# EAGLE board RPiOperant (EAGLE 9.1.3)
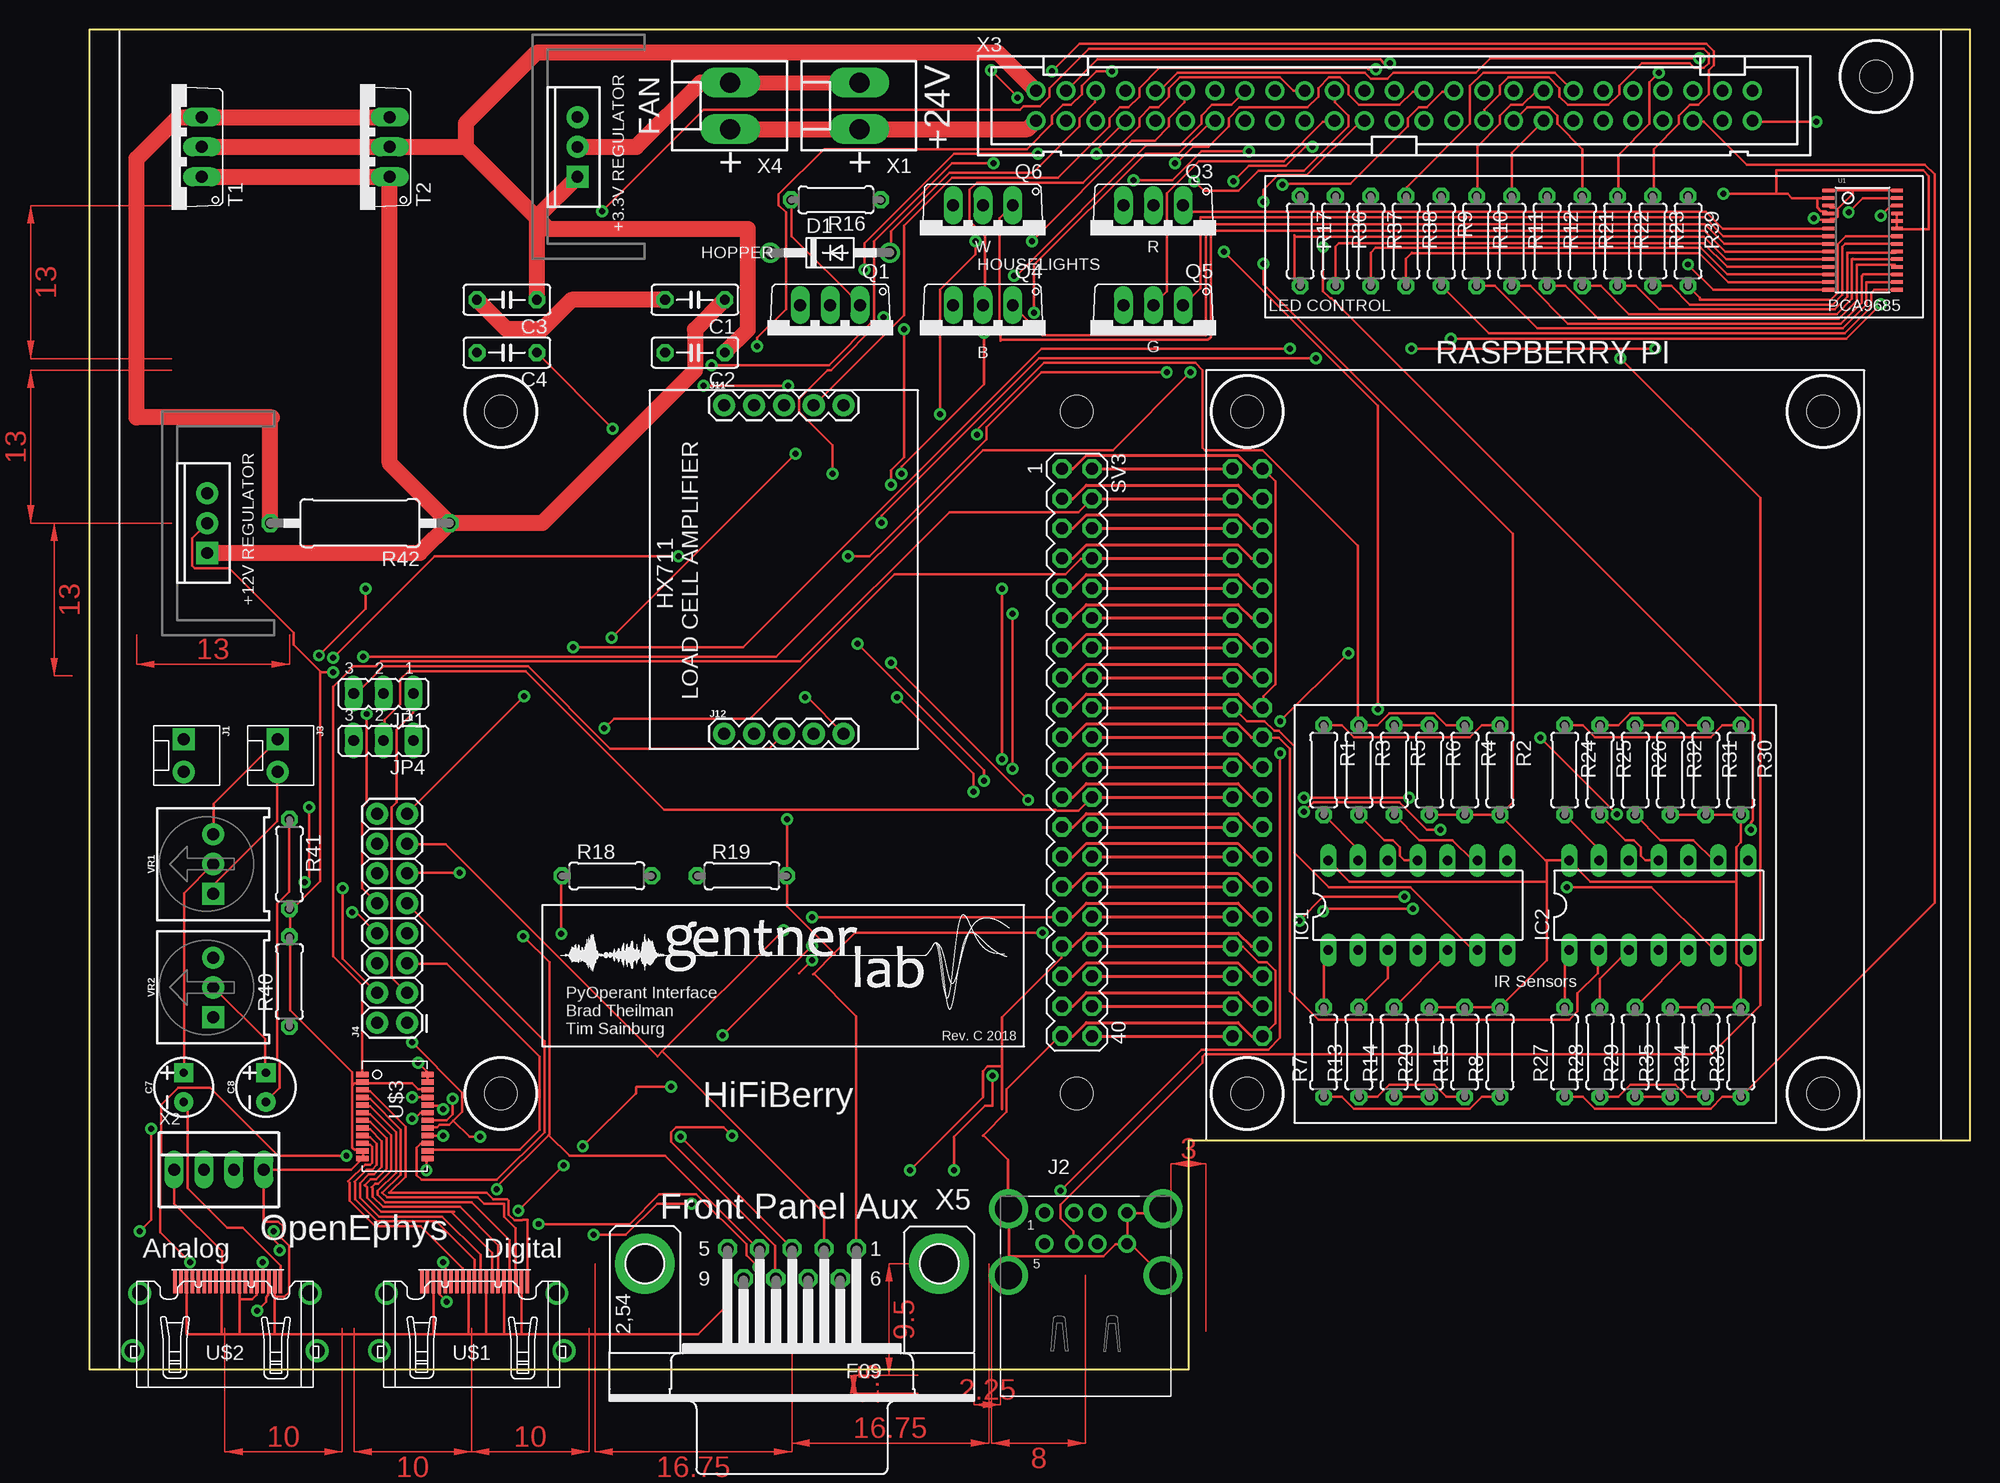
[diagram p3: board, top side]
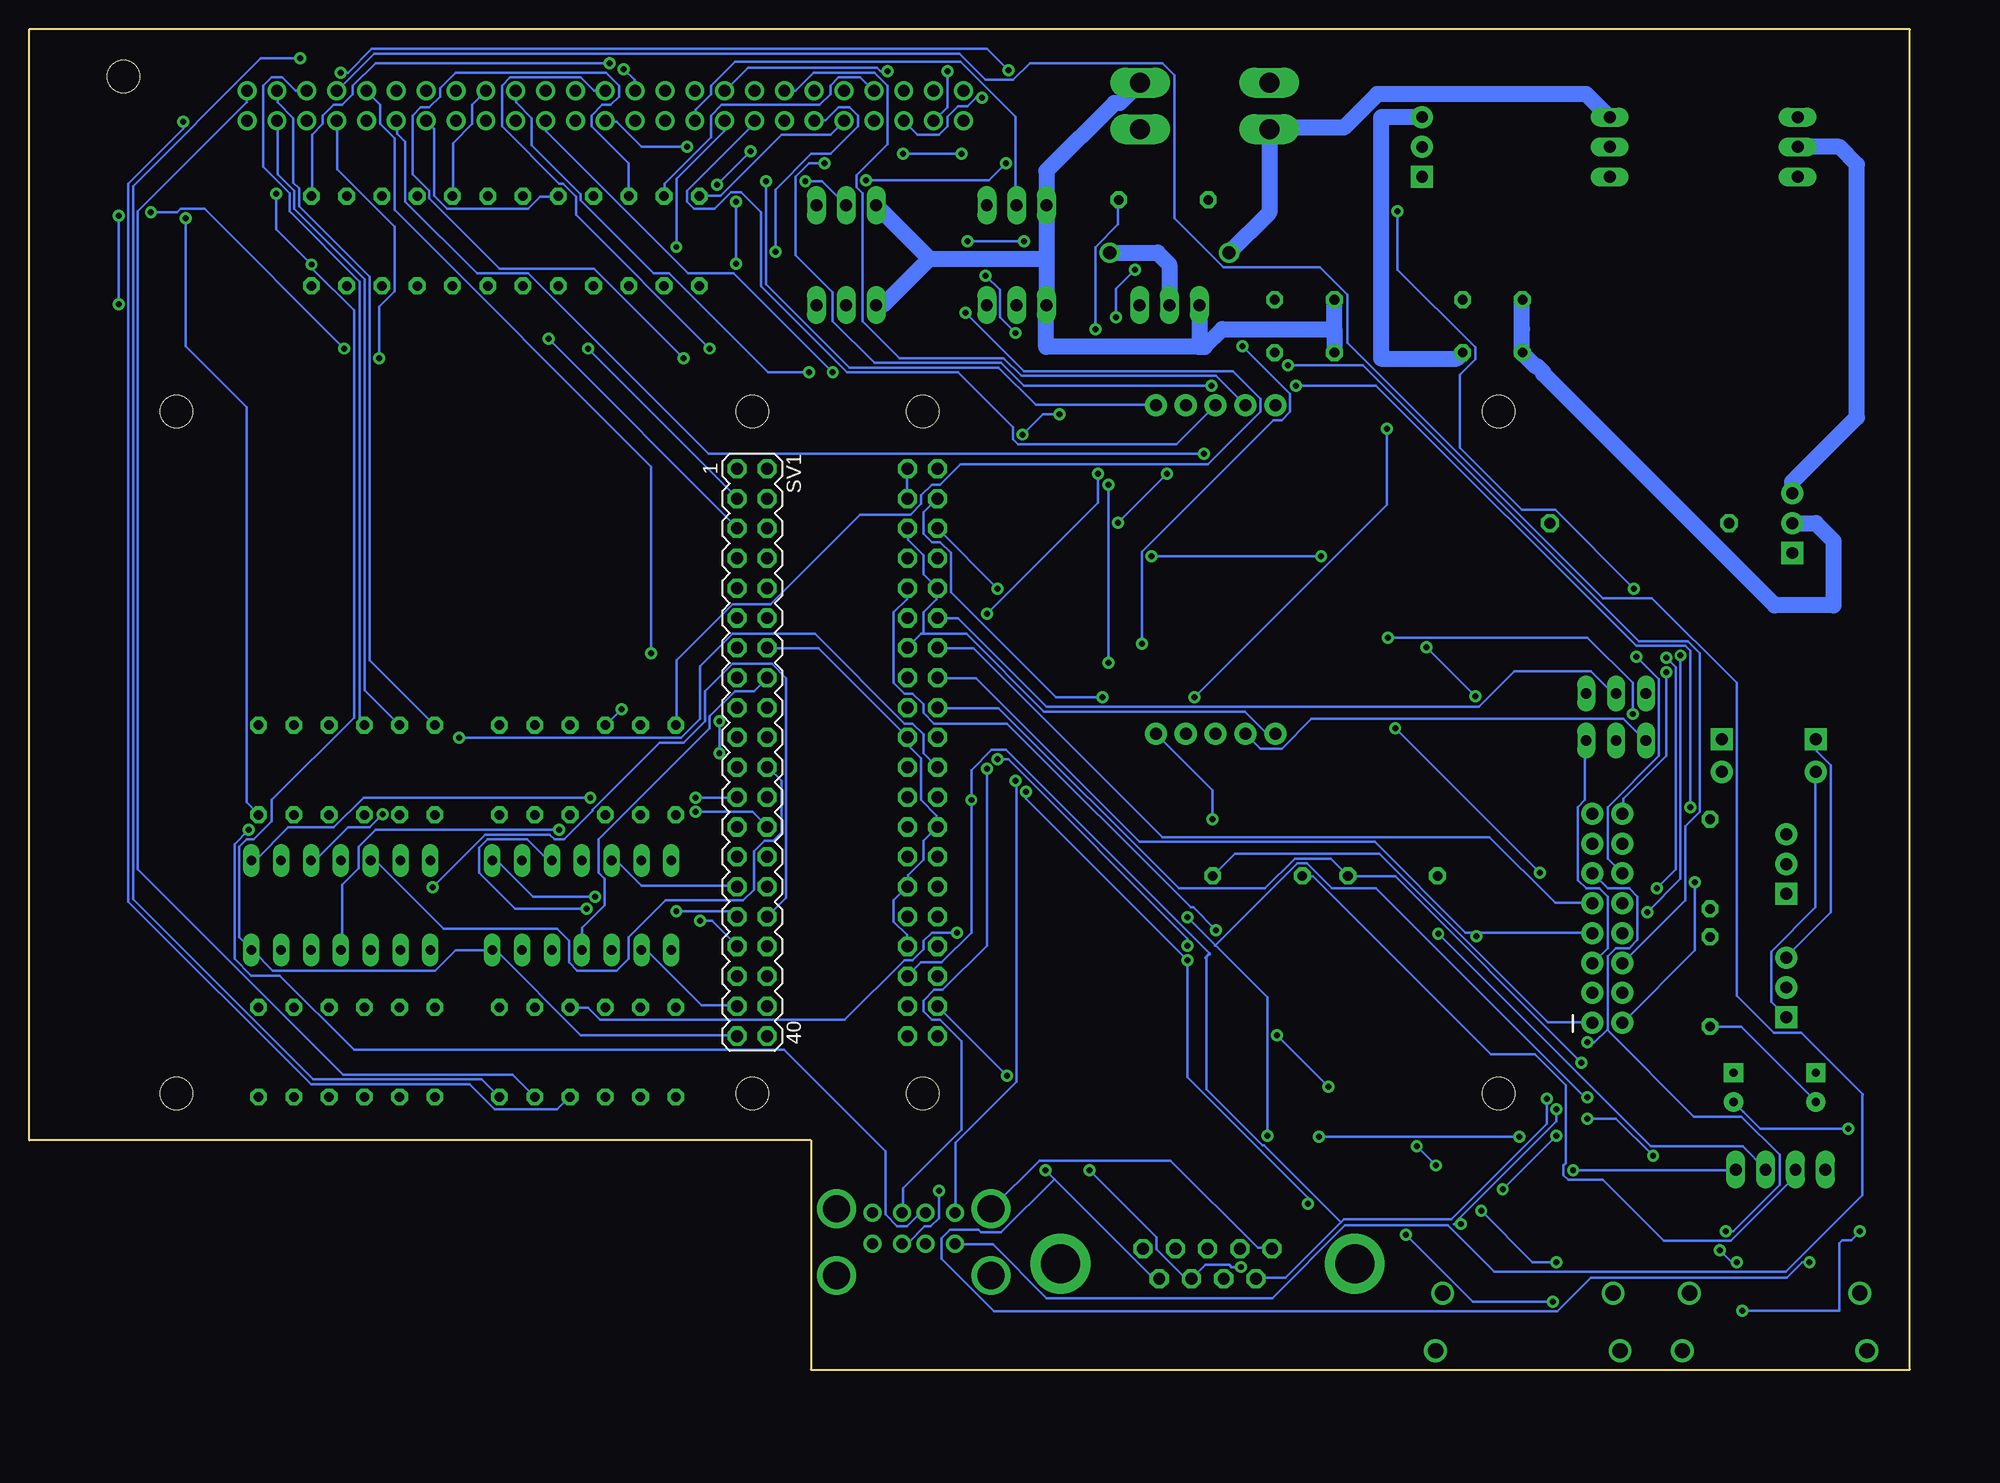
[diagram p4: board, bottom side, seen from below]

Size 160 x 114 mm. Coordinates in mm from the lower left corner, seen from the top.
Outline: 93.5,19.5 93.5,0 0,0 0,114 160,114 160,19.5 93.5,19.5
Copper layers (1*16): Top 0.035mm / dielectric 1.5mm / Bottom 0.035mm
Design rules "SparkFun": minimum track width 8mil, minimum drill 20mil, track to track 8mil, track to pad 8mil, pad to pad 8mil, via to via 8mil, smd to smd 8mil, copper to edge 8mil, drill to drill 8mil, minimum pad ring 12mil, minimum via ring 10mil, stop-mask expansion 4mil, vias tented up to drill 20mil, thermal gap 10mil
Net classes: 0 default: width 0.152 mm; 1 12V: width 1.372 mm, clearance 0.254 mm; 2 5V: width 0.508 mm; 3 GND: width 0.203 mm; 4 24V: width 1.372 mm
Holes 2.75 mm at 35,23.5 35,81.5 147.5,23.5 147.5,81.5 98.5,81.5 98.5,23.5 152,110 84,81.5 84,23.5
tKeepout: area 0,0 to 2,114; area 2,113 to 159,114
bKeepout: area 0,0 to 2,114; area 2,113 to 159,114
tRestrict: area 32,20.5 to 38,26.5; area 95,20.5 to 101.5,26.5; area 144.5,20.5 to 150.5,26.5; area 148.5,107 to 155,113; area 32,78.5 to 38,84.5; area 95,78.5 to 101.5,85; area 144.5,78.5 to 150.5,84.5; area 0,0 to 2,114; area 2,113 to 159,114; area 81,20.5 to 87,26.5; area 81,78.5 to 87,84.5; area 0,0 to 93.5,2; 3 more areas
bRestrict: area 32,78.5 to 38,84.5; area 32,20.5 to 38,26.5; area 95.5,78.5 to 101.5,84.5; area 32,78.5 to 38,84.5; area 95.5,20.5 to 101.5,26.5; area 144.5,20.5 to 150.5,26.5; area 144.5,78.5 to 150.5,84.5; area 149,107 to 155,113; area 0,0 to 2,114; area 2,113 to 159,114; area 81,20.5 to 87,26.5; area 81,78.5 to 87,84.5; 3 more areas
vRestrict: area 32,20.5 to 38,26.5; area 95.5,20.5 to 101.5,26.5; area 144.5,20.5 to 150.5,26.5; area 144.5,78.5 to 150.5,84.5; area 95.5,78.5 to 101.5,84.5; area 149,107 to 155,113; area 32,78.5 to 38,84.5; area 0,0 to 2,114; area 2,113 to 159,114; area 81,20.5 to 87,26.5; area 81,78.5 to 87,84.5; area 0,0 to 93.5,2; 3 more areas

## Footprints (pad centres in the part's own frame; a part is rotated, then mirrored left to right if it is on the bottom)
C050-025X075 = drill 0.813 octagon: 1 -2.54,0; 2 2.54,0
CPOL-RADIAL-2.5MM-5MM = drill 0.7 pad 1.651 square: 1 1.25,0 | drill 0.7 pad 1.651: 2 -1.25,0
DO41-10 = drill 1.118: A 5.08,0; C -5.08,0
DIL14 = drill 0.813 long: 1 -7.62,-3.81; 2 -5.08,-3.81; 3 -2.54,-3.81; 4 0,-3.81; 5 2.54,-3.81; 6 5.08,-3.81; 7 7.62,-3.81; 8 7.62,3.81; 9 5.08,3.81; 10 2.54,3.81; 11 0,3.81; 12 -2.54,3.81; 13 -5.08,3.81; 14 -7.62,3.81
MOLEX-1X2_LOCK = drill 1.016 pad 1.88 square: 1 -0.127,0 | drill 1.016 pad 1.88: 2 2.667,0
61400826021 = drill 0.92: 1 -3.5,5.33; 2 -1,5.33; 3 1,5.33; 4 3.5,5.33; 5 -3.5,2.71; 6 -1,2.71; 7 1,2.71; 8 3.5,2.71 | drill 2.3: SHELL -6.57,5.68; SHELL1 6.57,5.68; SHELL2 6.57,0; SHELL3 -6.57,0
2X8 = drill 1.016 pad 1.88: 1 0,0; 2 0,2.54; 3 2.54,0; 4 2.54,2.54; 5 5.08,0; 6 5.08,2.54; 7 7.62,0; 8 7.62,2.54; 9 10.16,0; 10 10.16,2.54; 11 12.7,0; 12 12.7,2.54; 13 15.24,0; 14 15.24,2.54; 15 17.78,0; 16 17.78,2.54
1X05 = drill 1.016 pad 1.88: 1 0,0; 2 2.54,0; 3 5.08,0; 4 7.62,0; 5 10.16,0
JP2 = drill 0.914 long: 1 -2.54,0; 2 0,0; 3 2.54,0
TO220V = drill 1.016 long: 1 -2.54,-2.54; 2 0,-2.54; 3 2.54,-2.54
0207/7 = drill 0.813 octagon: 1 -3.81,0; 2 3.81,0
0411/15 = drill 0.914 octagon: 1 -7.62,0; 2 7.62,0
MA20-2 = drill 1.016 octagon: 1 -24.13,-1.27; 2 -24.13,1.27; 3 -21.59,-1.27; 4 -21.59,1.27; 5 -19.05,-1.27; 6 -19.05,1.27; 7 -16.51,-1.27; 8 -16.51,1.27; 9 -13.97,-1.27; 10 -13.97,1.27; 11 -11.43,-1.27; 12 -11.43,1.27; 13 -8.89,-1.27; 14 -8.89,1.27; 15 -6.35,-1.27; 16 -6.35,1.27; 17 -3.81,-1.27; 18 -3.81,1.27; 19 -1.27,-1.27; 20 -1.27,1.27; 21 1.27,-1.27; 22 1.27,1.27; 23 3.81,-1.27; 24 3.81,1.27; 25 6.35,-1.27; 26 6.35,1.27; 27 8.89,-1.27; 28 8.89,1.27; 29 11.43,-1.27; 30 11.43,1.27; 31 13.97,-1.27; 32 13.97,1.27; 33 16.51,-1.27; 34 16.51,1.27; 35 19.05,-1.27; 36 19.05,1.27; 37 21.59,-1.27; 38 21.59,1.27; 39 24.13,-1.27; 40 24.13,1.27
TSSOP28 = smd 0.305 x 0.991: 1 -4.225,-2.918; 2 -3.575,-2.918; 3 -2.925,-2.918; 4 -2.275,-2.918; 5 -1.625,-2.918; 6 -0.975,-2.918; 7 -0.325,-2.918; 8 0.325,-2.918; 9 0.975,-2.918; 10 1.625,-2.918; 11 2.275,-2.918; 12 2.925,-2.918; 13 3.575,-2.918; 14 4.225,-2.918; 15 4.225,2.918; 16 3.575,2.918; 17 2.925,2.918; 18 2.275,2.918; 19 1.625,2.918; 20 0.975,2.918; 21 0.325,2.918; 22 -0.325,2.918; 23 -0.975,2.918; 24 -1.625,2.918; 25 -2.275,2.918; 26 -2.925,2.918; 27 -3.575,2.918; 28 -4.225,2.918
TO220-IGO = drill 1 pad 1.88: GND 0,0; OUT 2.54,0 | drill 1 pad 1.88 square: IN -2.54,0
HDMI_A = smd 0.3 x 1.9: P$1 4.75,3.95; P$2 4.25,3.95; P$3 3.75,3.95; P$4 3.25,3.95; P$5 2.75,3.95; P$6 2.25,3.95; P$7 1.75,3.95; P$8 1.25,3.95; P$9 0.75,3.95; P$10 0.25,3.95; P$11 -0.25,3.95; P$12 -0.75,3.95; P$13 -1.25,3.95; P$14 -1.75,3.95; P$15 -2.25,3.95; P$16 -2.75,3.95; P$17 -3.25,3.95; P$18 -3.75,3.95; P$19 -4.25,3.95 | drill 1.3: P$20 -7.25,3; P$21 7.25,3; P$22 7.85,-1.9; P$23 -7.85,-1.9
TSSOP-24 = smd 1.05 x 0.45: P1 -2.8,3.6; P2 -2.8,2.95; P3 -2.8,2.3; P4 -2.8,1.65; P5 -2.8,1; P6 -2.8,0.35; P7 -2.8,-0.3; P8 -2.8,-0.95; P9 -2.8,-1.6; P10 -2.8,-2.25; P11 -2.8,-2.9; P12 -2.8,-3.55; P13 2.75,-3.55; P14 2.75,-2.9; P15 2.75,-2.25; P16 2.75,-1.6; P17 2.75,-0.95; P18 2.75,-0.3; P19 2.75,0.35; P20 2.75,1; P21 2.75,1.65; P22 2.75,2.3; P23 2.75,2.95; P24 2.75,3.6
TRIMPOT-PTH-3386U = drill 1.016 pad 1.88 square: 1 -2.54,-0.015 | drill 1.016 pad 1.88: 2 0,-0.015; 3 2.54,-0.015
KK-156-2 = drill 1.7 pad 2.184 long: 1 -1.98,0; 2 1.98,0
22-23-2041 = drill 1 long: 1 -3.81,0; 2 -1.27,0; 3 1.27,0; 4 3.81,0
PAK100/2500-50 = drill 1 pad 1.422: 1 -30.48,-1.27; 2 -30.48,1.27; 3 -27.94,-1.27; 4 -27.94,1.27; 5 -25.4,-1.27; 6 -25.4,1.27; 7 -22.86,-1.27; 8 -22.86,1.27; 9 -20.32,-1.27; 10 -20.32,1.27; 11 -17.78,-1.27; 12 -17.78,1.27; 13 -15.24,-1.27; 14 -15.24,1.27; 15 -12.7,-1.27; 16 -12.7,1.27; 17 -10.16,-1.27; 18 -10.16,1.27; 19 -7.62,-1.27; 20 -7.62,1.27; 21 -5.08,-1.27; 22 -5.08,1.27; 23 -2.54,-1.27; 24 -2.54,1.27; 25 0,-1.27; 26 0,1.27; 27 2.54,-1.27; 28 2.54,1.27; 29 5.08,-1.27; 30 5.08,1.27; 31 7.62,-1.27; 32 7.62,1.27; 33 10.16,-1.27; 34 10.16,1.27; 35 12.7,-1.27; 36 12.7,1.27; 37 15.24,-1.27; 38 15.24,1.27; 39 17.78,-1.27; 40 17.78,1.27; 41 20.32,-1.27; 42 20.32,1.27; 43 22.86,-1.27; 44 22.86,1.27; 45 25.4,-1.27; 46 25.4,1.27; 47 27.94,-1.27; 48 27.94,1.27; 49 30.48,-1.27; 50 30.48,1.27
F09HP = drill 1.016 octagon: 1 -5.486,-1.27; 2 -2.743,-1.27; 3 0,-1.27; 4 2.743,-1.27; 5 5.486,-1.27; 6 -4.115,1.27; 7 -1.372,1.27; 8 1.372,1.27; 9 4.115,1.27 | drill 3.302 pad 5.08: G1 -12.522,0; G2 12.522,0

## Placement (x,y rotation side)
C1  100nF  [C050-025X075]  51.5,91 180 top
C2  10uF  [C050-025X075]  51.5,86.5 180 top
C3  100nF  [C050-025X075]  35.5,91 180 top
C4  10uF  [C050-025X075]  35.5,86.5 180 top
C7  10uF  [CPOL-RADIAL-2.5MM-5MM]  8,24 90 top
C8  10uF  [CPOL-RADIAL-2.5MM-5MM]  15,24 90 top
D1  1N4004  [DO41-10]  63,95 0 top
IC1  74LS14N  [DIL14]  113,39.5 0 top
IC2  74LS14N  [DIL14]  133.5,39.5 0 top
J1  [MOLEX-1X2_LOCK]  8,53.5 270 top
J2  [61400826021]  84.75,8 0 top
J3  [MOLEX-1X2_LOCK]  16,53.5 270 top
J4  [2X8]  27,29.5 90 top
J11  [1X05]  53.99,82.03 0 top
J12  [1X05]  53.99,54.09 0 top
JP1  [JP2]  25,57.5 180 top
JP4  [JP2]  25,53.5 180 top
Q1  IRLB8721  [TO220V]  63,88 180 top
Q3  IRLB8721  [TO220V]  90.5,96.5 180 top
Q4  IRLB8721  [TO220V]  76,88 180 top
Q5  IRLB8721  [TO220V]  90.5,88 180 top
Q6  IRLB8721  [TO220V]  76,96.5 180 top
R1  1k  [0207/7]  105,51 270 top
R2  4.3k  [0207/7]  120,51 270 top
R3  1k  [0207/7]  108,51 270 top
R4  4.3k  [0207/7]  117,51 270 top
R5  1k  [0207/7]  111,51 270 top
R6  4.3k  [0207/7]  114,51 270 top
R7  1k  [0207/7]  105,27 90 top
R8  4.3k  [0207/7]  120,27 90 top
R9  330  [0207/7]  115,96 270 top
R10  330  [0207/7]  118,96 270 top
R11  330  [0207/7]  121,96 270 top
R12  330  [0207/7]  124,96 270 top
R13  1k  [0207/7]  108,27 90 top
R14  1k  [0207/7]  111,27 90 top
R15  4.3k  [0207/7]  117,27 90 top
R16  1k  [0207/7]  63.5,99.5 180 top
R17  330  [0207/7]  103,96 270 top
R18  330  [0207/7]  44,42 0 top
R19  330  [0207/7]  55.5,42 0 top
R20  4.3k  [0207/7]  114,27 90 top
R21  330  [0207/7]  127,96 270 top
R22  330  [0207/7]  130,96 270 top
R23  330  [0207/7]  133,96 270 top
R24  1k  [0207/7]  125.5,51 270 top
R25  1k  [0207/7]  128.5,51 270 top
R26  1k  [0207/7]  131.5,51 270 top
R27  1k  [0207/7]  125.5,27 90 top
R28  1k  [0207/7]  128.5,27 90 top
R29  1k  [0207/7]  131.5,27 90 top
R30  4.3k  [0207/7]  140.5,51 270 top
R31  4.3k  [0207/7]  137.5,51 270 top
R32  4.3k  [0207/7]  134.5,51 270 top
R33  4.3k  [0207/7]  140.5,27 90 top
R34  4.3k  [0207/7]  137.5,27 90 top
R35  4.3k  [0207/7]  134.5,27 90 top
R36  330  [0207/7]  106,96 270 top
R37  330  [0207/7]  109,96 270 top
R38  330  [0207/7]  112,96 270 top
R39  330  [0207/7]  136,96 270 top
R40  330  [0207/7]  17,33 90 top
R41  330  [0207/7]  17,43 270 top
R42  1.5  [0411/15]  23,72 180 top
SV1  [MA20-2]  98.5,52.5 270 bottom
SV3  [MA20-2]  84,52.5 270 top
T1  TIP42  [TO220V]  7,104 90 top
T2  TIP42  [TO220V]  23,104 90 top
U1  [TSSOP28]  150.85,96.08 270 top
U2  7833  [TO220-IGO]  41.5,104 90 top
U3  7812  [TO220-IGO]  10,72 90 top
U$1  HDMI  [HDMI_A]  32.5,3.5 0 top
U$2  HDMI  [HDMI_A]  11.5,3.5 0 top
U$3  OCTAL_BUS_TRANSCEIVER  [TSSOP-24]  26,21.5 0 top
VR1  10k  [TRIMPOT-PTH-3386U]  10.5,43 90 top
VR2  10k  [TRIMPOT-PTH-3386U]  10.5,32.5 90 top
X1  [KK-156-2]  65.5,107.5 90 top
X2  22-23-2041  [22-23-2041]  11,17 0 top
X3  2550-  [PAK100/2500-50]  111,107.5 0 top
X4  [KK-156-2]  54.5,107.5 90 top
X5  [F09HP]  59.75,9 180 top

## Tracks (layer width: path | path; a pad name or v marks a point on that pad's centre or on a via)
12V
  Top 1.372: U2.IN 38.04,98 | 38.04,98 C3.1 | 32,104 T2.2 T1.2 | 32,104 38,98 38.04,98 | X3.2 77.29,112 38,112 32,106 32,104 | C2.1 56,88.46 56,97 39.04,97 38.04,98
  Bottom 1.372: U3.OUT 10,75.5 4.5,81 4.5,102.5 6,104 T1.2
24V
  Top 1.372: X4.1 X1.1 79.81,105.52 X3.1 | R42.2 15.38,80.88 15.5,81 4,81 4,103 7.54,106.54 T1.3 T2.3
  Bottom 1.372: D1.C 54.5,98.42 X4.1 53.85,105.65 48.16,105.65 45.31,108.49 27.53,108.49 25.6,106.56 T2.3
+3V3  (via drill 0.51)
  Top 0.203: R6.2 R4.2 R2.2 | R32.2 R31.2 R30.2 140.5,44.84 140.1,44.44 140.1,41.5 | R35.2 R34.2 R33.2 140.5,34.16 140.1,34.56 140.1,41.5 | R20.2 R15.2 R8.2 124,34.81 124,41.5 | R2.2 123.88,43.31 124,43.31 | 124,43.31 IC2.14 127.69,41.5 140.1,41.5 | 124,41.5 124,43.31 | IC1.14 107.19,41.5 124,41.5 | U1.1 150,100.31 | 150,100.31 U1.28 | 148.68,98.68 148.55,98.81 148.12,98.81 U1.3 | 148.68,98.68 148.73,98.63 148.73,98.08 148.55,97.9 148.12,97.9 U1.5 147.93,97.83 146.81,97.83 v146.71,97.93 | 148.68,98.68 150,100 150,100.31 | v99.87,99.35 99.87,100.37 101.09,101.58 103.53,101.58 108.1,106.16 108.41,106.16 X3.23 | v99.87,94.07 99.87,92.34 121.11,71.1 121.11,48.25 120.09,47.23 R2.2 | v59.33,46.82 59.33,42.05 R19.2 59.33,41.95 59.33,39.41 63.35,35.39 | 63.35,35.39 63.4,35.34 | v44.5,80.05 38.1,86.45 C4.1 | v60.86,57.19 61.06,57.19 64.11,54.14 J12.5 | v81.08,37.17 65.13,37.17 63.35,35.39 | 63.35,35.39 61.62,33.66 | 61.62,33.66 61.57,33.61 | 61.62,33.66 65.23,30.06 65.23,10.35 X5.1
  Bottom 0.203: v99.87,94.07 v99.87,99.35 | v146.71,97.93 146.71,87.06 141.53,81.87 141.53,48.25 140.51,47.23 R30.2 | v59.33,46.82 59.33,49.26 64.11,54.04 J12.5 | J4.1 27.03,29.55 30.79,29.55 45.11,43.88 57.4,43.88 59.23,42.05 R19.2 | v44.5,80.05 44.5,73.54 v60.86,57.19 | v81.08,37.17 83.21,37.17 83.92,36.46 83.92,35.75 84.84,34.83 85.55,34.83 90.63,29.75 111.45,29.75 112.47,30.77 114,30.77 R20.2
  Bottom 1.372: U2.OUT 44.96,106.54 45,106.5 45,86 38.54,86 C4.1
AUDIO_L+
  Top 0.203: VR1.1 10.57,40.52 10.57,41.23 15.95,46.62 15.95,50.78 J3.2
AUDIO_L-
  Top 0.203: VR1.3 10.57,45.6 10.57,48.14 15.95,53.53 J3.1
AUDIO_OUT_L
  Top 0.203: U$2.P$1 16.26,7.5 16.26,8.82 13.01,12.07 11.68,12.07 8.33,15.43 8.33,22.44 8.03,22.74 C7.2
  Bottom 0.203: 7.92,22.74 C7.2 8.03,22.84 14.33,29.14 16.97,29.14 R40.1
AUDIO_OUT_R  (via drill 0.51)
  Top 0.203: R41.1 16.97,46.72 16.97,40.62 15.95,39.61 15.95,26.4 16.15,26.2 16.15,23.96 15.04,22.84 C8.2 | U$2.P$3 15.21,7.4 15.21,6.37 15,6.17 15,5.75 v14.25,5 | v5.25,20.5 5.25,12.75 v4.25,11.75
  Bottom 0.203: 14.94,22.74 C8.2 14.18,21.93 14.16,21.93 12.73,20.5 v5.25,20.5 | v14.25,5 6,5 6,10.75 5.75,11 5,11 v4.25,11.75
AUDIO_R+
  Bottom 0.203: J1.2 8.03,50.78 8.03,39.3 11.79,35.55 11.79,31.28 10.57,30.06 VR2.1
AUDIO_R-
  Bottom 0.203: J1.1 7.92,53.53 7.92,52.61 6.71,51.39 6.71,38.9 10.46,35.14 VR2.3
AUX1  (via drill 0.51)
  Top 0.203: v102.11,86.85 80.97,86.85 55.58,61.45 v41.15,61.45 | v36.98,57.29 27.03,47.33 J4.15
  Bottom 0.203: v102.11,86.85 113.49,98.23 113.49,99.76 114.61,100.87 114.91,100.87 119.79,105.75 119.79,109.2 119.08,109.92 113.08,109.92 111.96,108.8 111.05,108.8 X3.26 | v36.98,57.29 v41.15,61.45
AUX3  (via drill 0.51)
  Top 0.203: v92.35,102.6 92.46,102.6 93.88,104.02 95.2,104.02 96.93,105.75 96.93,106.46 97.84,107.38 103.63,107.38 104.55,108.29 104.55,109 105.46,109.92 106.38,109.92 107.09,109.2 107.09,108.49 108,107.58 111.45,107.58 112.57,108.7 113.49,108.7 X3.28 | v52.22,83.7 v59.44,83.7 | v18.69,47.84 18.69,41.84 v18.29,41.44
  Bottom 0.203: v92.35,102.6 93.67,102.6 94.79,101.48 94.79,94.78 91.64,91.63 91.64,89.19 88.09,85.63 77.32,85.63 75.39,83.7 v59.44,83.7 | v52.22,83.7 45.41,83.7 23.27,61.55 19.1,61.55 18.69,61.15 v18.69,47.84 | v18.29,41.44 18.29,35.65 24.38,29.55 J4.2
AUX4  (via drill 0.51)
  Top 0.203: v91.64,84.82 80.97,84.82 76.3,80.15 76.3,79.13 66.34,69.17 v64.52,69.17 | v50.09,69.17 29.36,69.17 v20.73,60.54 | v21.54,40.93 21.54,34.94 24.38,32.09 J4.4
  Bottom 0.203: v91.64,84.82 100.08,93.25 103.94,93.25 116.03,105.34 116.03,106.16 X3.29 | v50.09,69.17 v64.52,69.17 | v20.73,60.54 19.91,59.73 19.91,42.55 v21.54,40.93
AUX5  (via drill 0.51)
  Top 0.203: v101.5,100.77 101.6,100.87 107.29,100.87 112.17,105.75 112.17,106.46 113.08,107.38 113.79,107.38 115.11,108.7 116.03,108.7 X3.30 | v98.65,103.62 94.59,103.62 92.15,101.18 v88.8,101.18 | v76.91,102.6 73.36,102.6 66.75,96 66.75,89.29 62.89,85.43 v52.93,85.43
  Bottom 0.203: v98.65,103.62 v101.5,100.77 | v88.8,101.18 78.33,101.18 v76.91,102.6 | v52.93,85.43 46.53,85.43 23.06,61.96 18.9,61.96 17.88,60.95 17.88,47.43 19.1,46.21 19.1,39.91 24.38,34.63 J4.6
AUX6  (via drill 0.51)
  Top 0.203: v43.59,98.54 52.22,107.17 79.15,107.17 79.45,107.48 80.87,107.48 81.69,108.29 81.69,109 85.04,112.35 137.36,112.35 137.77,111.95 137.77,111.14 137.36,110.73 136.55,110.73 136.14,111.14 132.08,111.14 130.15,109.2 130.15,108.49 129.24,107.58 125.78,107.58 125.07,108.29 125.07,109 124.16,109.92 120.7,109.92 119.99,109.2 119.99,108.49 118.67,107.17 118.67,106.26 X3.31 | v23.47,66.43 23.47,64.7 v19.51,60.74 | v22.35,38.9 22.66,38.9 24.38,37.17 J4.8
  Bottom 0.203: v43.59,98.54 43.59,93.56 36.98,86.95 36.98,85.94 38.3,84.62 38.3,78.42 33.02,73.14 30.18,73.14 v23.47,66.43 | v19.51,60.74 19.51,41.74 v22.35,38.9
AUX7  (via drill 0.51)
  Top 0.203: v93.67,84.82 87.07,78.22 76,78.22 58.42,60.64 v23.27,60.64
  Bottom 0.203: v93.67,84.82 97.13,84.82 105.56,93.25 106.88,93.25 113.08,99.45 113.08,99.96 117.25,104.12 117.25,106.46 118.57,107.78 118.57,108.7 X3.32 | v23.27,60.64 21.34,58.71 21.34,52.21 25.7,47.84 25.7,43.47 24.49,42.25 J4.12
AUX8  (via drill 0.51)
  Top 0.203: v44.4,62.27 v60.05,77.91 | v23.57,55.76 23.57,48.25 23.16,47.84 23.16,40.93 24.38,39.71 J4.10
  Bottom 0.203: v60.05,77.91 102.21,77.91 117.55,93.25 121.92,93.25 128.02,99.35 128.02,104.43 128.73,105.14 128.73,106.16 X3.39 | v44.4,62.27 27.43,62.27 23.57,58.41 v23.57,55.76
CENTER_IR  (via drill 0.51)
  Top 0.203: R5.1 R6.1 | v96.52,95.08 109.63,81.98 v109.63,56.17
  Bottom 0.203: v96.52,95.08 96.52,100.37 93.47,103.41 91.85,103.41 89.51,105.75 89.51,106.67 90.22,107.38 91.14,107.38 92.25,106.26 93.17,106.26 X3.11 | v109.63,56.17 110.95,54.85 R5.1
CENTER_LED
  Bottom 0.203: R36.1 105.97,99.86 105.97,100.87 102.01,104.84 102.01,106.67 101.09,107.58 92.76,107.58 91.85,108.49 91.85,109.2 91.14,109.92 89.31,109.92 88.19,108.8 X3.8
CENTER_PECK_GPIO  (via drill 0.51)
  Top 0.203: v111.86,40.22 104.95,40.22 v102.92,38.19 | v30.07,22.13 29.77,22.44 28.75,22.44 U$3.P20 | 77.62,22.13 77.62,25.79 | 77.62,25.79 77.62,29.96 82.7,35.04 82.7,35.95 SV3.33 | 77.62,25.79 76.4,25.79 76,25.38 76,23.15 v69.8,16.95 | v38.2,12.38 45.92,12.38 48.46,14.92 51.61,14.92 55.88,10.65 55.88,9.74 v56.9,8.72
  Top 0.254: SV3.33 83.65,35.99 84.8,37.13 97.7,37.13 98.85,35.99 SV1.33
  Bottom 0.203: v111.86,40.22 117.14,40.22 120.19,43.27 120.6,43.27 IC1.8 | v102.92,38.19 101.91,38.19 99.77,36.05 SV1.33 | v30.07,22.13 30.07,21.12 38.46,12.74 | 38.81,12.38 38.46,12.74 | v69.8,16.95 64.11,11.26 64.11,10.25 61.67,7.81 61.16,7.81 X5.7 61.06,7.81 59.94,8.93 57.91,8.93 57.71,8.72 v56.9,8.72 | 38.46,12.74 38.2,12.48 v38.2,12.38
DAT
  Top 0.203: JP1.3 22.55,57.59 22.76,57.59 24.99,59.83 37.29,59.83 44.3,52.82 57.81,52.82 59.03,54.04 J12.3
GND  (via drill 0.51)
  Top 0.203: U1.25 U1.24 U1.23 153.82,97 156.5,97 156.5,101.5 156,102 143.5,102 143.5,100 | U1.2 147,99.66 | 147,99.66 144.84,99.66 144.5,100 143.5,100 | U1.14 138.15,91.86 v136,94 | v139,100 143.5,100 | U1.4 147.74,98.55 147.31,98.55 147,98.86 147,99.66 | v20.73,59.32 19.71,59.32 19.66,59.37 | 19.66,59.37 17.37,61.66 17.37,62.67 11.89,68.16 8.94,68.16 8.74,68.36 8.74,70.7 9.96,71.92 U3.GND | U$3.P22 28.65,23.86 27.94,23.86 27.43,24.37 23.27,24.37 U$3.P2 23.16,24.37 22.55,24.37 22.4,24.22 | v28.65,16.95 28.65,17.87 U$3.P13 | 16.31,11.21 16.46,11.36 16.46,12.18 16.05,12.58 14.81,12.58 X2.4 22.25,17 U$3.P12 23.27,17.97 23.27,18.58 U$3.P11 23.16,18.68 22.55,18.68 22.35,18.88 22.35,24.17 22.4,24.22 | 16.31,11.21 16.26,11.16 | 22.4,24.22 22.35,24.27 22.35,25.28 17.07,30.57 17.07,36.76 R40.2 17.07,36.87 17.07,39.1 R41.2 17.17,39.1 19.61,41.54 19.61,59.32 19.66,59.37 | SV1.34 97.33,35.95 98.15,35.95 99.47,34.63 100.18,34.63 100.89,33.92 100.89,29.45 99.87,28.43 SV1.39 | SV3.39 82.7,28.33 82.5,28.33 78.03,23.86 78.03,21.93 76.05,19.95 | 76.05,19.95 76,19.9 | U$1.P$2 36.75,3 | 36.75,3 35.25,3 | 35.25,3 33.75,3 | 33.75,3 32.25,3 | 32.25,3 29.25,3 | U$1.P$5 35.25,3 | U$1.P$8 33.75,3 | U$1.P$11 32.25,3 | U$1.P$17 29.25,3 | 29.25,3 15.75,3 | U$2.P$2 15.75,6.18 | 15.75,6.18 15.75,3 | U$2.P$8 12.75,6 | 12.75,6 12.75,3 | 12.75,3 15.75,3 | 12.75,3 11.25,3 | 11.25,3 8.25,3 U$2.P$17 | 11.25,3 U$2.P$11 11.28,7.5 11.28,10.04 7.21,14.11 7.21,16.95 X2.1 | 36.75,3 51.75,3 54.26,5.51 X5.5 | J2.8 88.29,10.75 88.29,13.29 J2.4 88.39,13.29 90.93,13.29 91.24,13.6 J2.SHELL1 | J2.SHELL2 91.24,8.01 88.49,10.75 88.39,10.75 J2.8 | 15.75,6.18 16.56,6.18 16.97,6.59 16.97,10.55 16.31,11.21
  Top 0.203: 78.23,9.64 78.23,13.6 J2.SHELL 78.13,13.7 78.13,17.87 76.05,19.95 | 78.23,9.64 78.23,8.01 J2.SHELL3 78.23,9.64 | 78.23,9.64 86.26,9.64 87.27,10.65 88.19,10.65 J2.8 | U$2.P$5 14.21,7.4 14.21,6.37 13.83,6 12.75,6
  Top 0.254: SV3.6 SV1.6 | SV3.9 83.65,66.47 84.8,67.61 97.7,67.61 98.85,66.47 SV1.9 | SV3.14 SV1.14 | SV3.20 SV1.20 | SV3.25 83.65,46.15 84.8,47.29 97.7,47.29 98.85,46.15 SV1.25 | SV3.30 SV1.30 | SV3.34 SV1.34 | SV3.39 83.65,28.37 84.8,29.51 97.7,29.51 98.85,28.37 SV1.39
  Top 1.27: X4.2 X1.2
  Top 1.372: U2.GND 46.5,104 51.98,109.48 X4.2 | C1.2 41,91 38.5,88.5 35.46,88.5 C3.2
  Bottom 0.203: v139,100 139,97 v136,94 135.94,93.97 135.94,93.66 132.38,90.1 132.38,55.46 139.4,48.45 139.4,46.62 140.92,45.09 141.53,45.09 142.14,44.49 142.14,36.76 141.12,35.75 IC2.7 141.02,35.65 139.29,33.92 125.48,33.92 123.75,35.65 120.7,35.65 IC1.7 120.6,35.65 120.29,35.65 113.08,28.43 99.77,28.43 SV1.39 | v20.73,59.32 20.73,52.21 24.38,48.55 24.38,47.33 J4.16 | v28.65,16.95 14.83,16.95 X2.4 | SV3.6 85.24,71.51 85.24,70.6 83.92,69.28 83.92,67.65 82.8,66.53 SV3.9 82.8,66.43 82.8,65.52 83.92,64.4 83.92,62.57 | 83.92,62.57 84.12,62.57 85.24,61.45 SV3.14 | 83.92,62.57 80.26,62.57 73.66,55.97 56.59,55.97 54.76,54.14 54.05,54.14 J12.1 | SV3.34 85.34,36.05 85.34,36.97 86.46,38.09 86.46,39.91 85.34,41.03 SV3.30 85.24,41.13 85.24,42.05 83.92,43.37 83.92,44.99 82.8,46.11 SV3.25 82.8,46.21 82.8,47.13 84.12,48.45 84.12,52 85.24,53.12 85.24,53.73 SV3.20 85.34,53.83 92.86,61.35 97.13,61.35 SV1.14 | 54.24,10.25 X5.5 54.36,10.35 55.47,10.35 62.89,17.77 74.07,17.77 78.13,13.7 J2.SHELL
  Bottom 1.372: X1.2 67.25,107.73 67.69,107.73 73.46,101.97 Q6.3 73.46,94.5 | 73.46,94.5 Q4.3 73.5,90.5 73.5,87 60.5,87 | Q3.3 83.42,94.5 | 83.42,94.5 73.46,94.5 | Q5.3 87.38,90.54 83.42,94.5 | Q1.3 60.46,87.04 60.5,87 | 60.5,87 60,87 58.5,88.5 49,88.5 48.96,88.54 | 48.96,88.54 C1.2 | 48.96,88.54 C2.2 | C3.2 33,90.96 33,88.5 33.04,88.54 33.04,86.58 | 33.04,86.58 C4.2 | U3.GND 8,72 6.5,70.5 6.5,65 11.5,65 31.19,84.69 31.19,84.84 31.66,85.31 31.81,85.31 33.04,86.54 33.04,86.58
GPIO4
  Top 0.254: SV3.7 83.65,69.01 84.8,70.15 97.7,70.15 98.85,69.01 SV1.7
GPIO8
  Top 0.203: JP4.2 25.09,53.53 25.09,55.26 26.42,56.58 26.42,58.71 27.13,59.42 37.08,59.42 48.87,47.64 82.19,47.64 82.3,47.53 84.12,47.53 85.24,48.65 SV3.24
  Top 0.254: SV3.24 SV1.24
GPIO8EXT
  Top 0.203: U$3.P14 28.75,18.68 36.58,18.68 38.3,20.41 38.3,26.6 30.38,34.53 27.03,34.53 J4.5
  Bottom 0.203: JP4.1 27.64,53.43 27.64,48.45 28.25,47.84 28.25,41.64 27.53,40.93 26.42,40.93 25.7,40.22 25.7,35.85 26.92,34.63 J4.5
GPIO17
  Top 0.254: SV3.11 83.65,63.93 84.8,65.07 97.7,65.07 98.85,63.93 SV1.11
  Bottom 0.203: JP1.2 25.09,57.59 25.3,57.59 27.13,59.42 33.63,59.42 36.68,56.37 73.46,56.37 80.97,63.89 82.7,63.89 SV3.11
GPIO17EXT
  Top 0.203: JP1.1 27.53,55.87 26.11,54.44 26.11,48.25 25.7,47.84 25.7,33.31 26.92,32.09 J4.3
GPIO22  (via drill 0.51)
  Top 0.203: v30.07,19.9 U$3.P16 | v34.65,15.33 34.65,15.53 39.06,19.95 | 39.06,19.95 39.12,20 39.12,34.63 v36.88,36.87 | 39.06,19.95 40.84,18.17 48.97,18.17 56.79,10.35 57,10.35 X5.4
  Top 0.254: SV3.15 83.65,58.85 84.8,59.99 97.7,59.99 98.85,58.85 SV1.15
  Bottom 0.203: v34.65,15.33 v30.07,19.9 | 36.88,37.17 37.8,37.17 45.52,44.89 65.53,44.89 79.45,58.81 82.7,58.81 SV3.15 | 36.88,37.17 27.03,37.17 J4.7 | 36.88,37.17 v36.88,36.87
GPIO27
  Top 0.203: U$3.P15 28.65,19.19 28.14,19.19 27.84,18.88 27.84,16.55 28.25,16.14 34.65,16.14 38.71,20.2 38.71,27.93 27.03,39.61 J4.9
  Top 0.254: SV3.13 83.65,61.39 84.8,62.53 97.7,62.53 98.85,61.39 SV1.13
  Bottom 0.203: SV3.13 82.7,61.35 79.65,61.35 63.6,45.3 35.76,45.3 30.18,39.71 27.03,39.71 J4.9
HOPPER
  Top 0.203: X3.6 85.55,108.7 85.55,107.78 84.23,106.46 84.23,105.75 80.26,101.79 73.15,101.79 68.17,96.81 68.17,95.08 D1.A
  Bottom 1.372: D1.A 64,95 63,94 Q1.2
HOPPER_IR  (via drill 0.51)
  Top 0.203: R1.1 106.56,54.81 107.58,53.79 117.42,53.79 118.44,54.81 R2.1 | v80.37,89.9 80.37,93.97 89.81,103.41 92.66,103.41 95.4,106.16 95.71,106.16 X3.13
  Bottom 0.203: v80.37,89.9 75.39,84.92 57.61,84.92 55.27,82.59 55.27,81.47 59.74,77 80.77,77 82.5,75.27 83.21,75.27 84.12,74.36 84.12,73.65 85.04,72.73 89.31,72.73 96.93,65.11 100.18,65.11 104.95,60.34 104.95,54.85 R1.1
HOPPER_IR_GPIO
  Top 0.254: SV3.29 83.65,41.07 84.8,42.21 97.7,42.21 98.85,41.07 SV1.29
  Bottom 0.203: IC1.12 110.44,43.27 110.03,43.27 107.9,41.13 99.77,41.13 SV1.29
HOPPER_TRIG_GPIO  (via drill 0.51)
  Top 0.203: v30.89,23.05 30.89,21.73 30.38,21.22 28.75,21.22 U$3.P18 | v69.29,88.48 69.29,77.61 68.17,76.49 v68.17,75.27 | v79.86,48.45 v68.17,60.13
  Top 0.254: SV3.36 SV1.36
  Bottom 0.203: v30.89,23.05 30.89,20.91 39.01,12.79 48.16,12.79 48.41,12.53 | v69.29,88.48 69.29,95.49 67.36,97.42 67.36,99.45 R16.1 | v68.17,60.13 v68.17,75.27 | SV3.36 85.24,33.51 84.12,34.63 82.4,34.63 79.86,37.17 v79.86,48.45 79.86,50.99 78.13,52.72 76.91,52.72 59.59,35.39 | 59.59,35.39 59.54,35.34 | 59.59,35.39 59.89,35.09 | 59.89,35.09 59.94,35.04 | 48.41,12.53 53.14,7.81 55.58,7.81 X5.9 | 48.41,12.53 54.97,19.09 55.07,19.09 59.84,23.86 59.84,35.04 59.89,35.09
HOUSELIGHT_B
  Top 0.203: X3.20 103.33,108.8 102.41,108.8 101.3,109.92 92.76,109.92 91.85,109 91.85,108.29 90.93,107.38 90.22,107.38 89.31,106.46 89.31,105.75 84.53,100.97 75.49,100.97 74.88,100.37 74.88,97.72 76.2,96.4 76.2,90.71 76.1,90.61 Q4.2
HOUSELIGHT_B_GPIO
  Top 0.203: U1.8 139.1,95.75 137.43,97.42 95.08,97.42 95,97.5 95,88 81.08,88 Q4.1
HOUSELIGHT_G
  Top 0.203: X3.21 105.87,106.16 104.95,106.16 101.6,102.8 94.39,102.8 91.64,100.06 91.64,91.73 90.53,90.61 Q5.2
HOUSELIGHT_G_GPIO
  Top 0.203: U1.7 139.02,96.41 137.43,98 94.5,98 94.5,92 Q5.1
HOUSELIGHT_R  (via drill 0.51)
  Top 0.203: v93.98,101.08 94.79,100.26 97.74,100.26 99.47,101.99 103.33,101.99 107.09,105.75 107.09,106.67 105.97,107.78 105.97,108.7 X3.22
  Bottom 0.203: v93.98,101.08 92.56,101.08 90.53,99.05 Q3.2
HOUSELIGHT_R_GPIO
  Top 0.203: U1.6 138.94,97.06 137.5,98.5 93.58,98.5 Q3.1
HOUSELIGHT_W
  Bottom 0.203: X3.19 103.33,106.26 103.33,107.17 102.01,108.49 102.01,109.2 99.97,111.24 80.77,111.24 76.1,106.56 76.1,99.05 Q6.2
HOUSELIGHT_W_GPIO
  Top 0.203: U1.9 139.17,95.11 137.39,96.89 95.61,96.89 95.5,97 95.41,96.91 95.41,87.83 95.17,87.59 77.59,87.59 77.5,87.5 77.5,89.19 77.42,89.26 77.42,97.92 Q6.1
ID_SC
  Top 0.254: SV3.28 SV1.28
ID_SD
  Top 0.254: SV3.27 83.65,43.61 84.8,44.75 97.7,44.75 98.85,43.61 SV1.27
IR_1
  Top 0.203: R13.1 109.56,23.19 110.58,24.21 114.42,24.21 115.44,23.19 R15.1
  Bottom 0.203: X3.50 141.53,108.7 141.53,107.78 150.77,98.54 150.77,42.55 133.3,25.08 118.87,25.08 117.04,23.25 R15.1
IR_1_GPIO
  Top 0.254: SV3.16 SV1.16
  Bottom 0.203: IC1.4 112.98,35.75 112.98,37.58 111.05,39.51 111.05,41.74 111.56,42.25 111.56,45.09 102.11,54.54 102.11,55.56 99.97,57.69 98.35,57.69 97.23,58.81 SV1.16
IR_2  (via drill 0.51)
  Top 0.203: R14.1 R20.1 | v146.91,106.16 141.53,106.16 X3.49
  Bottom 0.203: v146.91,106.16 146.91,105.55 151.59,100.87 151.59,39.81 136.04,24.27 122.53,24.27 120.4,22.13 115.11,22.13 114.1,23.15 R20.1
IR_2_GPIO
  Top 0.203: IC1.6 118.06,35.75 117.65,35.75 112.37,41.03 105.46,41.03 102.51,43.98 102.51,53.02 101.19,54.34 100.79,54.34 99.97,55.15 98.45,55.15 97.33,56.27 SV1.18
  Top 0.254: SV3.18 SV1.18
IR_3
  Top 0.203: R24.1 127.06,54.81 128.08,53.79 137.92,53.79 138.94,54.81 R30.1
  Bottom 0.203: X3.48 138.89,108.7 138.89,107.78 137.57,106.46 137.57,100.97 137.06,100.47 137.06,98.94 131.06,92.95 131.06,60.34 125.58,54.85 R24.1
IR_3_GPIO
  Top 0.254: SV3.22 SV1.22
  Bottom 0.203: IC2.12 130.86,43.27 130.56,43.27 124.77,37.48 115.11,37.48 114.1,36.46 114.1,34.63 113.39,33.92 110.03,33.92 109.02,34.94 109.02,36.76 105.87,39.91 99.26,39.91 98.35,40.83 98.35,44.08 97.43,44.99 96.72,44.99 96.01,45.7 96.01,50.07 97.13,51.19 SV1.22
IR_4
  Top 0.203: R25.1 130.06,54.81 131.08,55.83 134.92,55.83 135.94,54.81 R31.1
  Bottom 0.203: X3.47 138.89,106.16 138.89,101.69 137.47,100.26 137.47,98.74 131.47,92.75 131.47,57.8 128.52,54.85 R25.1
IR_4_GPIO  (via drill 0.51)
  Top 0.203: v123.44,53.73 v129.95,47.23
  Top 0.254: SV3.21 83.65,51.23 84.8,52.37 97.7,52.37 98.85,51.23 SV1.21
  Bottom 0.203: v129.95,47.23 131.06,46.11 132.89,46.11 135.64,43.37 135.94,43.37 IC2.10 | v123.44,53.73 104.55,53.73 102.92,55.36 102.92,59.83 100.18,62.57 93.17,62.57 85.55,54.95 84.84,54.95 83.92,54.04 83.92,52.41 82.8,51.29 SV3.21
IR_5
  Top 0.203: R26.1 R32.1
  Bottom 0.203: X3.46 136.45,108.8 137.36,108.8 138.48,109.92 139.4,109.92 140.11,109.2 140.11,102.3 137.87,100.06 137.87,98.54 131.88,92.54 131.88,55.15 131.57,54.85 R26.1
IR_5_GPIO  (via drill 0.51)
  Top 0.203: v103.33,48.65 v112.27,48.65
  Top 0.254: SV3.23 83.65,48.69 84.8,49.83 97.7,49.83 98.85,48.69 SV1.23
  Bottom 0.203: v112.27,48.65 131.57,48.65 134.11,46.11 137.97,46.11 140.72,43.37 141.02,43.37 IC2.8 | v103.33,48.65 99.77,48.65 SV1.23
IR_6
  Top 0.203: R27.1 127.06,23.19 128.08,22.17 137.92,22.17 138.94,23.19 R33.1 140.51,23.25 156.97,39.71 156.97,101.69 156.16,102.5 141.02,102.5 137.36,106.16 136.45,106.16 X3.45
IR_6_GPIO
  Top 0.203: IC2.2 128.32,35.65 128.32,33.72 126.59,31.99 126.59,30.46 125.88,29.75 104.55,29.75 102.11,32.19 102.11,52.82 101.19,53.73 99.87,53.73 SV1.19
  Top 0.254: SV3.19 83.65,53.77 84.8,54.91 97.7,54.91 98.85,53.77 SV1.19
IR_7
  Top 0.203: R28.1 130.06,23.19 131.08,24.21 134.92,24.21 135.94,23.19 R34.1
IR_7_GPIO  (via drill 0.51)
  Top 0.203: v114.91,45.91 113.79,45.91 111.45,48.25 104.14,48.25 v103.33,47.43
  Top 0.254: SV3.26 SV1.26
  Bottom 0.203: v114.91,45.91 130.56,45.91 131.98,44.49 131.98,42.66 133.4,41.23 133.4,35.75 IC2.4 | v103.33,47.43 98.45,47.43 97.23,46.21 SV1.26
IR_8
  Top 0.203: R29.1 R35.1
IR_8_GPIO  (via drill 0.51)
  Top 0.203: v125.68,41.03 132.89,41.03 138.18,35.75 138.48,35.75 IC2.6
  Top 0.254: SV3.32 SV1.32
  Bottom 0.203: v125.68,41.03 121.21,45.5 115.72,45.5 115.32,45.09 114.5,45.09 112.06,47.53 112.06,47.64 106.38,53.33 104.34,53.33 102.51,55.15 102.51,57.69 100.18,60.03 96.83,60.03 95.61,58.81 95.61,40.12 97.13,38.59 SV1.32
LCCLK
  Bottom 0.203: JP4.3 22.55,53.53 24.38,55.36 50.9,55.36 53.44,52.82 55.27,52.82 56.49,54.04 J12.2
LED_1
  Top 0.203: R38.1 112.06,99.86 112.06,100.57 117.45,105.95 117.45,109.2 118.57,110.32 124.66,110.32 126.19,108.8 X3.38
LED_2
  Bottom 0.203: R9.1 115.01,99.76 116.53,99.76 117.55,98.74 124.46,98.74 125.58,99.86 125.58,105.55 126.19,106.16 X3.37
LED_3
  Top 0.203: R10.1 118.06,99.86 118.06,104.02 119.99,105.95 119.99,106.67 120.9,107.58 121.92,107.58 123.04,108.7 123.65,108.7 X3.36
LED_4
  Top 0.203: R11.1 121.01,99.86 121.01,103.52 123.65,106.16 X3.35
LED_5
  Bottom 0.203: R12.1 123.95,99.86 123.95,104.33 122.33,105.95 122.33,107.58 121.21,108.7 X3.34
LED_6
  Top 0.203: R21.1 127,103.82 124.87,105.95 124.87,106.67 124.16,107.38 122.33,107.38 121.21,106.26 X3.33
LEFT_IR  (via drill 0.51)
  Top 0.203: R4.1 115.44,54.81 114.42,55.83 110.58,55.83 109.56,54.81 R3.1 107.9,54.85 107.9,70.09 99.77,78.22 94.89,78.22 94.69,78.42 94.69,85.02 94.08,85.63 81.18,85.63 75.49,79.94 v75.49,79.54 | v80.16,96 88.7,104.53 90.63,104.53 91.85,105.75 91.85,106.46 93.17,107.78 93.17,108.7 X3.12 | v75.39,96 75.39,94.88 72.34,91.83 v72.34,81.27
  Bottom 0.203: v75.39,96 v80.16,96 | v72.34,81.27 73.76,81.27 v75.49,79.54
LEFT_LED
  Bottom 0.203: R17.1 102.92,99.86 101.19,99.86 96.01,105.04 91.85,105.04 90.73,106.16 X3.9
LEFT_PECK_GPIO  (via drill 0.51)
  Top 0.203: v112.57,39.2 105.16,39.2 v104.95,39 | v27.43,23.15 28.65,23.15 U$3.P21 | v61.47,38.49 82.7,38.49 SV3.31 | v54.66,19.9 53.95,20.61 49.89,20.61 49.48,20.2 49.48,19.39 58.32,10.55 58.32,7.81 X5.8
  Top 0.254: SV3.31 83.65,38.53 84.8,39.67 97.7,39.67 98.85,38.53 SV1.31
  Bottom 0.203: v112.57,39.2 118.67,39.2 121.72,42.25 121.72,44.38 121.01,45.09 117.65,45.09 115.93,43.37 115.62,43.37 IC1.10 | v104.95,39 100.18,39 99.77,38.59 SV1.31 | v27.43,23.15 27.64,23.15 45.41,40.93 49.17,40.93 51.31,43.06 52.12,43.06 59.08,36.1 | 59.13,36.05 59.08,36.1 | 59.08,36.1 v61.47,38.49 | v54.66,19.9 54.66,31.68 59.08,36.1
LOADCELLA+
  Bottom 0.203: X3.15 98.35,106.16 98.35,105.95 104.04,100.26 104.04,99.35 103.43,98.74 101.7,98.74 100.28,100.16 99.47,100.16 97.74,98.44 97.74,92.14 90.42,84.82 80.97,84.82 76.3,80.15 76.3,79.13 75.89,78.72 62.38,78.72 59.13,81.98 J11.3
LOADCELLA-
  Bottom 0.203: X3.14 95.71,108.8 94.79,108.8 93.27,110.32 88.09,110.32 86.97,109.2 86.97,104.23 89.61,101.58 89.61,100.57 89.1,100.06 89.1,89.19 85.95,86.04 77.11,86.04 75.59,84.52 59.03,84.52 56.59,82.08 J11.2
LOADCELLE+  (via drill 0.51)
  Top 0.203: v104.04,104.02 103.43,104.02 101.8,102.4 98.65,102.4 v97.33,101.08
  Bottom 0.203: v104.04,104.02 107.9,104.02 110.03,106.16 110.95,106.16 X3.25 | v97.33,101.08 97.33,92.34 90.22,85.23 77.52,85.23 74.37,82.08 64.21,82.08 J11.5
LOADCELLE-  (via drill 0.51)
  Top 0.203: v109.42,110.63 108.81,110.63 108.71,110.73 91.03,110.73 89.31,109 89.31,108.29 88.39,107.38 87.68,107.38 86.77,106.46 86.77,105.75 82.4,101.38 73.36,101.38 69.29,97.32 69.29,89.7 61.67,82.08 J11.4
  Bottom 0.203: v109.42,110.63 108.51,109.71 108.51,108.8 X3.24
N$1
  Top 0.203: R13.2 110.46,33.27 IC1.3
N$2
  Top 0.203: R14.2 115.54,35.35 IC1.5
N$3
  Top 0.203: R24.2 128.42,44.27 IC2.13
N$4
  Top 0.203: IC2.11 132.38,43.31 131.98,43.71 131.98,44.44 131.38,45.04 130.65,45.04 R25.2
N$5
  Top 0.203: R26.2 133.65,45.04 136.46,45.04 138.19,43.31 IC2.9
N$6
  Top 0.203: R1.2 107.92,44.27 IC1.13
N$7
  Top 0.203: R27.2 125.5,35.31 IC2.1
N$8
  Top 0.203: IC1.11 111.88,43.31 111.48,43.71 111.48,44.44 110.88,45.04 110.15,45.04 R3.2
N$9
  Top 0.203: R28.2 128.5,33.23 IC2.3
N$10
  Top 0.203: R5.2 113.15,45.04 115.96,45.04 117.69,43.31 IC1.9
N$11
  Top 0.203: R29.2 136.04,35.35 IC2.5
N$12
  Top 0.203: R7.2 105,35.31 IC1.1
N$13
  Top 0.203: U1.10 139.25,94.45 137.35,96.35 102.65,96.35 102.52,96.48 102.5,96.48 102.5,92.69 R17.2
N$14
  Top 0.203: U1.11 139.32,93.81 137.31,95.81 106.31,95.81 106,95.5 R36.2
N$15
  Top 0.203: U1.12 139.34,93.16 137.09,95.41 109.41,95.41 109,95 R37.2
N$16
  Top 0.203: U1.13 139.42,92.5 136.96,94.96 112.54,94.96 112.5,95 112,94.5 R38.2
N$17
  Top 0.203: U$3.P3 23.32,23.68 23.85,23.68 26.88,20.66 26.88,16.42 25.5,15.05 33.78,15.05 34.32,14.5 35.5,14.5 35.66,14.34 35.66,13.16 36.14,12.68 36.81,12.68 36.88,12.75 37.25,12.75 U$1.P$1
N$18
  Top 0.203: U$3.P4 23.32,23.03 23.85,23.03 26.47,20.41 26.47,16.59 24.91,15.03 25.29,14.64 33,14.64 33.55,14.09 35.25,14.09 35.26,14.09 35.26,12.99 36.25,12 U$1.P$3
N$19
  Top 0.203: U1.20 153.66,95 149.54,95 149.54,91.24 148.49,90.19 133.57,90.19 131.56,92.19 R22.2
N$20
  Top 0.203: U1.21 149.39,95.75 149.14,95.5 149.14,91.41 148.32,90.59 136.16,90.59 134.56,92.19 R23.2
N$21
  Top 0.203: U1.22 149.41,96.41 148.73,95.73 148.73,91.58 148.16,91 137,91 137,91.19 R39.2
N$22
  Top 1.372: R42.1 25.54,77.08 T2.1 T1.1 | U3.IN 28.08,69.46 R42.1 | C1.1 51.5,88.46 51.5,85 38.5,72 R42.1
N$24
  Top 0.203: R16.2 59.74,99.45 59.74,96.4 65.53,90.61 Q1.1
N$25
  Bottom 0.203: R19.1 51.61,41.95 50.8,41.95 35.66,26.81 31.9,26.81 29.26,24.17 29.26,17.56 29.46,17.36 29.46,16.55 29.06,16.14 26.11,16.14 20.93,10.96 15.24,10.96 9.75,16.44 9.75,16.95 X2.2
N$26
  Top 0.203: U1.15 151.85,91.86 151.58,91.58 151.58,90.4 149.33,88.16 119.03,88.16 R9.2
N$27
  Top 0.203: U1.16 151.17,92.5 151.17,90.57 149.17,88.56 123.19,88.56 119.56,92.19 R10.2
N$28
  Top 0.203: U1.17 150.92,93.16 150.76,93 150.76,90.73 149,88.97 125.78,88.97 122.56,92.19 R11.2
N$29
  Top 0.203: U1.18 153.57,94 153.15,94 153.14,94 150.36,94 150.36,90.9 148.83,89.37 128.38,89.37 125.56,92.19 R12.2
N$30
  Top 0.203: U1.19 150.04,94.45 150,94.5 149.95,94.45 149.95,91.07 148.66,89.78 130.97,89.78 128.56,92.19 R21.2
N$31  (via drill 0.51)
  Top 0.203: v40.13,37.07 40.13,41.95 R18.1
  Bottom 0.203: v40.13,37.07 22.05,18.98 14.22,18.98 12.29,17.05 X2.3
N$32
  Top 0.203: U$3.P5 23.32,22.38 23.85,22.38 26.06,20.17 26.06,16.76 24.5,15.2 24.5,14.86 25.13,14.23 32.5,14.23 35.75,10.98 U$1.P$4
N$33
  Top 0.203: U$3.P6 23.32,21.73 23.85,21.73 25.66,19.93 25.66,16.93 24.52,15.79 24.3,15.79 24,15.5 24.09,15.41 24.09,14.69 24.96,13.83 31.5,13.83 34.75,10.58 U$1.P$6
N$34
  Top 0.203: C7.1 8.03,25.28 8.03,40.52 10.46,42.96 VR1.2
N$35
  Top 0.203: C8.1 14.94,25.28 14.94,28.13 10.57,32.5 VR2.2
N$36
  Top 0.203: U$3.P7 23.32,21.08 23.85,21.08 25.25,19.68 25.25,17.09 24.36,16.2 23.93,16.2 23.41,15.68 23.59,15.5 23.59,14.62 24.79,13.42 30.75,13.42 | 31,13.42 30.75,13.42 | 30.75,13.42 34.25,9.92 U$1.P$7
N$37
  Top 0.203: U$3.P8 23.32,20.43 23.85,20.43 24.84,19.44 24.84,17.26 24.19,16.61 23.76,16.61 23,15.85 23,14.63 24.62,13.01 30,13.01 33.25,9.76 U$1.P$9
N$38
  Top 0.203: U$3.P9 23.32,19.78 23.85,19.78 24.44,19.2 24.44,17.43 24.02,17.01 23.59,17.01 22.54,15.96 22.59,15.91 22.59,14.47 24.45,12.61 29.5,12.61 32.75,9.36 U$1.P$10
N$39
  Top 0.203: U$3.P10 23.32,19.13 23.85,19.13 24.03,18.95 24.03,17.6 23.85,17.42 23.42,17.42 22,16 22.13,15.87 22.13,14.35 24.28,12.2 28.17,12.2 31.75,8.62 U$1.P$12
PCM_CLK
  Top 0.254: SV3.12 SV1.12
PCM_DIN
  Top 0.254: SV3.38 SV1.38
PCM_DOUT
  Top 0.254: SV3.40 SV1.40
PCM_FS
  Top 0.254: SV3.35 83.65,33.45 84.8,34.59 97.7,34.59 98.85,33.45 SV1.35
RGB_CUE_B  (via drill 0.51)
  Top 0.203: v110.64,111.14 110.13,111.14 109.83,111.44 85.75,111.44 83.11,108.8 X3.4
  Bottom 0.203: v110.64,111.14 130.56,111.14 132.49,109.2 132.49,108.49 133.4,107.58 134.11,107.58 135.03,106.67 135.03,105.95 135.94,105.04 135.94,99.86 R39.1
RGB_CUE_G  (via drill 0.51)
  Top 0.203: v81.89,110.42 84.23,112.76 137.57,112.76 138.18,112.15 138.18,110.93 137.77,110.53 137.77,108.49 136.85,107.58 136.14,107.58 135.23,106.67 135.23,105.95 133.1,103.82 133.1,99.86 R23.1
  Bottom 0.203: v81.89,110.42 81.89,107.38 83.01,106.26 X3.3
RGB_CUE_R  (via drill 0.51)
  Top 0.203: v133.5,110.32 132.69,109.51 132.69,105.95 130.05,103.31 130.05,99.86 R22.1 | v76.71,110.53 78.94,108.29 v78.94,108.19
  Bottom 0.203: v133.5,110.32 132.89,110.32 130.86,112.35 78.54,112.35 v76.71,110.53 | v78.94,108.19 79.45,108.19 80.16,107.48 80.97,107.48 81.89,106.56 81.89,105.75 82.6,105.04 84.43,105.04 85.55,106.16 X3.5
RIGHT_IR  (via drill 0.51)
  Top 0.203: R7.1 106.56,23.19 107.58,22.17 117.42,22.17 118.44,23.19 R8.1 | v136.96,111.54 119.18,111.54 117.96,110.32 110.95,110.32 110.44,109.81 109.02,109.81 108.51,110.32 92.56,110.32 91.03,108.8 90.73,108.8 X3.10
  Bottom 0.203: v136.96,111.54 140.31,111.54 151.18,100.67 151.18,40.02 135.84,24.67 121.51,24.67 120.09,23.25 R8.1
RIGHT_LED  (via drill 0.51)
  Top 0.203: v104.34,86.04 80.77,86.04 67.36,72.63 v67.36,72.02 | v63.2,76.19 63.2,78.62 60.35,81.47 60.35,82.59 62.79,85.02 63.09,85.02 v67.56,89.49 | v65.94,93.56 65.94,95.79 73.56,103.41 v80.67,103.41 | v85.65,103.41 85.65,103.72 88.09,106.16 X3.7
  Bottom 0.203: v104.34,86.04 111.96,93.66 119.99,93.66 125.98,99.65 125.98,100.26 127.41,101.69 127.41,106.67 126.69,107.38 125.98,107.38 125.07,108.29 125.07,109 123.75,110.32 110.95,110.32 109.83,109.2 109.83,108.29 110.54,107.58 111.25,107.58 112.17,106.67 112.17,105.75 109.02,102.6 109.02,99.86 R37.1 | v63.2,76.19 v67.36,72.02 | v67.56,89.49 67.56,91.93 v65.94,93.56 | v85.65,103.41 v80.67,103.41
RIGHT_PECK_GPIO  (via drill 0.51)
  Top 0.203: 27.43,21.12 27.58,21.27 | 27.58,21.27 28.14,21.83 28.65,21.83 U$3.P19 | v76.81,24.98 76.81,22.44 76.2,22.44 73.56,19.8 v73.56,16.95 | v27.43,21.32 27.53,21.32 27.58,21.27 | v21.84,18.17 16.05,18.17 10.26,23.96 7.52,23.96 6.1,22.54 6.1,18.37 5.99,18.27 5.99,11.67 v8.53,9.13
  Top 0.254: SV3.37 83.65,30.91 84.8,32.05 97.7,32.05 98.85,30.91 SV1.37
  Bottom 0.203: IC1.2 107.9,35.65 107.49,35.65 102.82,30.97 99.77,30.97 SV1.37 | v76.81,24.98 82.7,30.87 SV3.37 | v27.43,21.32 24.99,21.32 v21.84,18.17 | v73.56,16.95 72.8,16.19 | 72.8,16.19 64.41,7.81 63.91,7.81 X5.6 | 72.8,16.19 77.32,11.67 79.05,11.67 79.25,11.87 81.69,11.87 82.4,11.16 82.4,9.43 77.93,4.96 29.97,4.96 27.13,7.81 10.46,7.81 9.14,9.13 v8.53,9.13
RPI_3.3V  (via drill 0.51)
  Top 0.203: SV1.17 99.87,56.37 99.87,57.29 100.89,58.3 100.89,75.58 99.87,76.59 SV1.1 | U$3.P23 28.75,24.47 28.75,25.08 U$3.P24 28.65,25.18 28.65,25.38 v27.94,26.1
  Top 0.254: SV3.1 83.65,76.63 84.8,77.77 97.7,77.77 98.85,76.63 SV1.1 | SV3.17 83.65,56.31 84.8,57.45 97.7,57.45 98.85,56.31 SV1.17
  Bottom 0.203: v27.94,26.1 43.79,41.95 47.75,41.95 R18.2 47.85,42.05 49.28,43.47 52.32,43.47 54.86,40.93 62.18,40.93 77.52,56.27 82.7,56.27 SV3.17
RPI_5V
  Top 0.203: U$3.P1 23.16,25.18 23.16,32.7 20.73,35.14 20.73,58.1 22.45,59.83 24.38,59.83 24.79,60.23 60.45,60.23 73.15,72.93 84.12,72.93 85.24,74.05 SV3.4
  Top 0.254: SV3.2 SV1.2 | SV3.4 SV1.4
  Bottom 0.203: SV3.2 85.34,76.59 85.34,74.15 SV3.4
RXD  (via drill 0.51)
  Top 0.203: J4.13 27.03,44.69 30.28,44.69 48.31,26.66 48.72,27.06 | 48.72,27.06 v59.03,37.37 | 48.72,27.06 62.48,13.29 62.48,10.35 X5.2
  Top 0.254: SV3.10 SV1.10
  Bottom 0.203: v59.03,37.37 60.96,39.3 61.16,39.3 76.81,54.95 83.01,54.95 83.92,55.87 83.92,56.58 84.84,57.49 85.55,57.49 86.46,58.41 86.46,64.4 85.34,65.52 85.34,66.43 SV3.10
SCL  (via drill 0.51)
  Top 0.203: v152.4,98.13 153.21,98.94 153.72,98.94 U1.26 | v152.4,90.61 149.45,87.67 v115.82,87.67 | v77.62,66.43 v77.62,51.9 | v49.48,24.06 46.53,24.06 46.5,24 46.5,23.5 46.43,23.45 v41.96,18.98 | v61.47,36.05 v53.85,28.43 | v40.34,17.36 v36.47,13.5 | v30.07,9.13 30.28,8.93 30.28,7.5 U$1.P$15
  Top 0.254: SV3.5 83.65,71.55 84.8,72.69 97.7,72.69 98.85,71.55 SV1.5
  Bottom 0.203: v152.4,90.61 v152.4,98.13 | v115.82,87.67 99.77,71.61 SV1.5 | v77.62,51.9 76.71,51.9 61.47,36.66 v61.47,36.05 | v77.62,66.43 82.7,71.51 SV3.5 | v53.85,28.43 v49.48,24.06 | v41.96,18.98 v40.34,17.36 | v30.07,9.13 32.11,9.13 v36.47,13.5
SDA  (via drill 0.51)
  Top 0.203: v149.66,98.44 150.88,99.65 153.72,99.65 U1.27 | v112.47,86.85 v133.2,86.85 | v75.18,49.16 75.18,50.68 v68.68,57.19 | v61.47,34.83 60.35,33.72 | v30.38,5.78 29.77,6.39 29.77,7.4 U$1.P$16 | v42.88,11.47 45.62,11.47 48.26,14.11 v51.21,14.11
  Top 0.254: SV3.3 83.65,74.09 84.8,75.23 97.7,75.23 98.85,74.09 SV1.3
  Bottom 0.203: v149.66,98.44 147.42,98.44 147.12,98.74 145.09,98.74 v133.2,86.85 | v112.47,86.85 99.77,74.15 SV1.3 | v68.68,57.19 72.64,57.19 81.58,66.13 81.58,69.48 82.5,70.39 83.21,70.39 83.92,71.1 83.92,72.93 82.8,74.05 SV3.3 | v75.18,49.16 75.18,48.55 v61.47,34.83 61.47,24.88 51.21,14.62 v51.21,14.11 | v30.38,5.78 37.19,5.78 v42.88,11.47
TXD  (via drill 0.51)
  Top 0.203: 30.94,21.17 31.7,21.93 31.7,23.56 v27.43,27.82 | 30.94,21.17 30.58,20.81 29.77,20.81 29.57,20.61 28.75,20.61 U$3.P17 | 15.24,11.36 v15.65,11.77 | v33.22,19.8 32.31,19.8 30.94,21.17 | v43.79,54.54 44.6,55.36 56.19,55.36 68.48,67.65 83.01,67.65 84.33,68.97 85.24,68.97 SV3.8 | v31.5,42.25 27.03,42.25 J4.11 | 15.38,11.5 v15.65,11.77 | v14.73,9.13 14.73,7.5 U$2.P$4 | v16.15,10.14 16.15,10.55 15.34,11.36 v15.65,11.77 | v50.29,19.8 59.74,10.35 X5.3
  Top 0.254: SV3.8 SV1.8
  Bottom 0.203: v27.43,27.82 26.82,27.82 25.76,28.89 | 25.76,28.89 25.7,28.94 25.7,35.14 24.99,35.85 23.88,35.85 23.16,36.56 23.16,40.22 23.88,40.93 25.7,40.93 26.92,42.15 J4.11 | v15.65,11.77 15.04,11.77 11.07,15.73 11.07,18.27 14.33,21.52 18.39,21.52 25.76,28.89 | v33.22,19.8 v50.29,19.8 | v31.5,42.25 v43.79,54.54 | v14.73,9.13 15.14,9.13 v16.15,10.14
USB1_D+  (via drill 0.51)
  Top 0.203: v78.54,64.3 v78.54,51.09 | v69.09,76.19 69.09,76.79 76.1,83.81 v76.1,88.17 | v78.64,93.05 78.84,93.05 89.92,104.12 92.76,104.12 94.59,105.95 94.59,106.67 95.5,107.58 97.13,107.58 98.25,108.7 X3.16
  Bottom 0.203: v78.54,51.09 78.54,36.05 82.3,32.29 83.01,32.29 83.92,31.38 83.92,30.46 83.21,29.75 82.5,29.75 80.67,27.93 80.67,20.41 85.65,15.43 85.65,13.4 J2.3 | v78.54,64.3 69.09,73.75 v69.09,76.19 | v76.1,88.17 77.42,89.49 77.42,91.83 v78.64,93.05
USB1_D-  (via drill 0.51)
  Top 0.203: v141.33,45.91 141.33,46.52 141.53,46.72 141.53,55.26 105.66,91.12 105.56,91.12 104.95,91.73 v104.95,95.49
  Bottom 0.203: v141.33,45.91 142.54,44.69 142.54,34.94 141.12,33.51 138.68,33.51 132.38,27.21 95.81,27.21 87.17,18.58 87.17,13.19 86.16,12.18 85.34,12.18 84.23,13.29 83.82,13.29 J2.2 | v104.95,95.49 104.95,101.28 100.89,105.34 100.89,106.16 X3.17
USB1_VBUS  (via drill 0.51)
  Top 0.203: v76.1,50.07 76.1,50.99 v65.33,61.76 | v56.79,87.06 56.79,87.77 59.23,90.21 59.23,98.44 58.62,99.05 58.62,99.96 62.48,103.82 79.76,103.82 81.89,105.95 81.89,106.67 82.8,107.58 83.52,107.58 84.43,108.49 84.43,109.2 85.65,110.42 v86.97,110.42
  Bottom 0.203: v76.1,50.07 76,49.97 76,24.47 81.18,19.29 81.18,13.4 J2.1 | v65.33,61.76 65.33,69.58 54.15,80.76 53.44,80.76 52.73,81.47 52.73,82.99 v56.79,87.06 | v86.97,110.42 87.58,110.42 87.88,110.73 98.86,110.73 100.79,108.8 X3.18
USB2_D+  (via drill 0.51)
  Top 0.203: v101.3,52.41 101.3,28.23 100.28,27.21 94.59,27.21 v82.6,15.22 | v107.09,60.95 v101.3,55.15
  Bottom 0.203: v101.3,55.15 v101.3,52.41 | v107.09,60.95 107.09,76.79 128.93,98.64 128.93,104.73 130.15,105.95 130.15,107.58 131.27,108.7 X3.42 | v82.6,15.22 82.6,12.89 83.31,12.18 83.82,12.18 85.24,10.75 85.65,10.75 J2.7
USB2_D-  (via drill 0.51)
  Top 0.203: v130.25,86.04 142.14,74.15 142.14,30.97 137.97,26.81 94.89,26.81 94.69,26.6 94.69,26.1 82.6,14.01 82.6,12.89 83.72,11.77 83.72,10.75 J2.6
  Bottom 0.203: v130.25,86.04 130.25,90.41 128.93,91.73 128.93,97.22 133.81,102.09 133.81,106.16 X3.43
USB2_VBUS
  Bottom 0.203: X3.44 133.81,108.8 130.66,111.95 80.87,111.95 78.64,109.71 76.3,109.71 74.88,111.14 63.6,111.14 62.59,110.12 62.59,97.93 58.42,93.76 50.19,93.76 47.85,91.42 47.85,87.36 26.11,65.62 21.95,65.62 14.73,58.41 14.73,31.79 11.58,28.64 9.25,28.64 4.01,23.4 | 4,23.39 4.01,23.4 | J2.5 81.18,10.65 78.03,10.65 73.46,6.08 54.25,6.08 48.06,12.28 39.32,12.28 35.36,8.32 10.57,8.32 4.06,14.82 4.06,23.35 4.01,23.4
(copper drawn outside any net)
  shapes: Top area x14

## Text on the board
tPlace: +24V | FAN | +3.3V REGULATOR | + | + | W | R | HOPPER | HOUSELIGHTS | LED CONTROL | PCA9685 | RASPBERRY PI | B | G | +12V REGULATOR | HX711 / LOAD CELL AMPLIFIER | IR Sensors | PyOperant Interface / Brad Theilman / Tim Sainburg | Rev. C 2018 | HiFiBerry | /home/brad/Pictures/gentnerlab_logo_inverted.bmp | Front Panel Aux | OpenEphys | Analog | Digital